# Altium schematic sheet Power Supply.SchDoc
size A; SheetNumber: 2; SheetTotal: 4
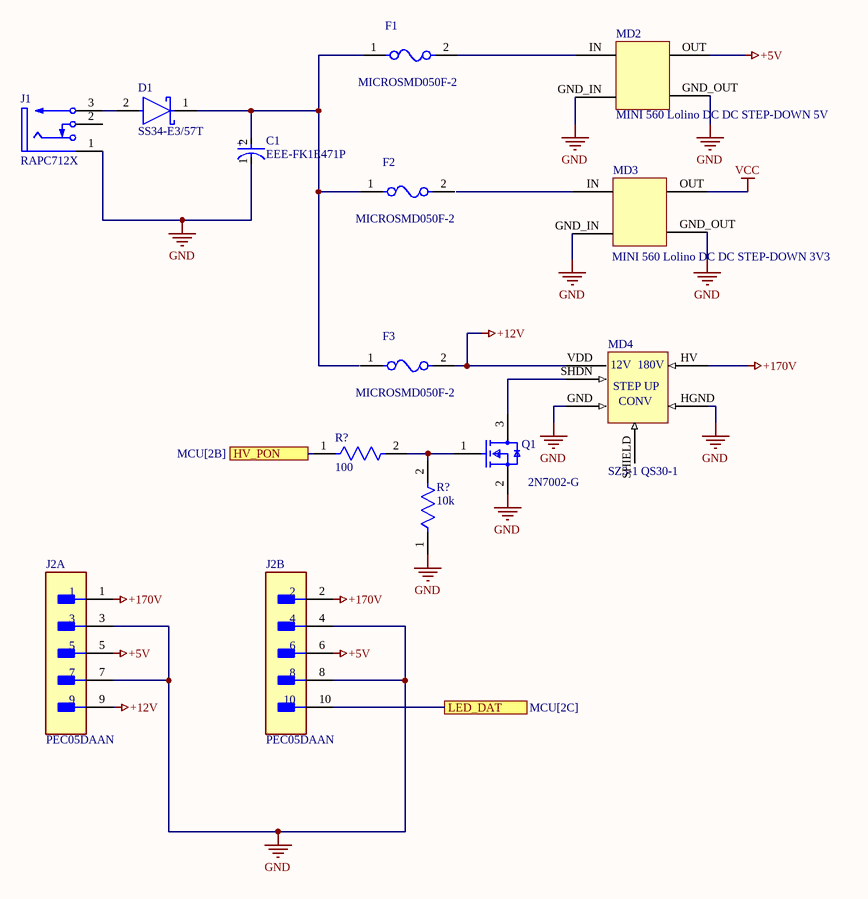
[diagram p0: Power Supply.SchDoc]

## Parts
(Parts that share a designator on the sheet are numbered #1, #2 ... from top to bottom, then left to right.)
C1  EEE-FK1E471P  [FP-FKG-MFG]
D1  SS34-E3/57T  [FP-95402-MFG]
F1  MICROSMD050F-2  [FP-microSMD-MFG]
F2  MICROSMD050F-2  [FP-microSMD-MFG]
F3  MICROSMD050F-2  [FP-microSMD-MFG]
J1  RAPC712X  [SWITCH-RAPC712X-3_V]
J2  PEC05DAAN  [FP-PEC05DAAN-MFG]  (parts A,B of 2)
MD2  MINI 560 Lolino DC DC STEP-DOWN 5V  [MINI 560 Lolino DC DC STEP-DOWN]
MD3  MINI 560 Lolino DC DC STEP-DOWN 3V3  [MINI 560 Lolino DC DC STEP-DOWN]
MD4  SZ3-1 QS30-1  [STEP_UP_180V]
Q1  2N7002-G  [FP-2N7002-G-IPC_C]
R?#1  100  [FP-RC0805-0_6-IPC_C]
R?#2  10k  [FP-RC0805-0_6-IPC_C]

## Ports
HV_PON (see MCU[2B]), LED_DAT (see MCU[2C])

## Nets
+5V: J2.5 J2.6 MD2.OUT
+12V: F3.2 J2.9 MD4.VDD
+170V: J2.1 J2.2 MD4.HV
GND: C1.1(C) J1.1 J2.3 J2.4 J2.7 J2.8 MD2.GND_IN MD2.GND_OUT MD3.GND_IN MD3.GND_OUT MD4.GND MD4.HGND Q1.2(SOURCE) R?#2.1
VCC: MD3.OUT
HV_PON: R?#1.1 ; port HV_PON
LED_DAT: J2.10 ; port LED_DAT
NetC1_2: C1.2(A) D1.1(C) F1.1 F2.1
NetD1_2: D1.2(A) J1.3
NetF1_2: F1.2 MD2.IN
NetMD4_SHDN: MD4.SHDN Q1.3(DRAIN)
NetQ1_1: Q1.1(GATE) R?#1.2 R?#2.2

Not connected (* = marked no-connect by the designer): F2 2; F3 1; J1 2; MD3 IN; MD4 SHIELD

## Notes on the sheet
- (in symbol CMP-05427-000095-1) +
- (in symbol STEP_UP_180V_MODULE) 12V; 180V; STEP UP; CONV

## Library data of the parts
C1 = CMP-05427-000095-1: CAP ALUM 470UF 20% 25V SMD; Dielectric Material: Aluminium; Life (Hours): 2000Hour; Impedance: 80mR; Leakage Current: 3uA; Polarity: Polar; Ripple Current (AC): 850mA; Packaging: Tape and Reel; Height: 10.2mm; Radiation Hardening: No; Mount: Surface Mount; Min Operating Temperature: -55°C; ESR (Equivalent Series Resistance): 80mR; Tolerance: 20%; Max Operating Temperature: 105°C; Contact Plating: Tin; Length: 10.2mm; Number of Pins: 2; Capacitance: 470uF; Case/Package: Radial; Height - Seated (Max): 0.413inch; Voltage Rating (DC): 25V; Construction: Cylindrical; Lead Free: Lead Free; Voltage: 25V; Material: Aluminium; Package Quantity: 500; Width: 12mm; Series: FK; RoHS Compliant: Yes; Voltage Rating: 25V; Ripple Current: 850mA; Termination: SMD/SMT; Diameter: 10mm
D1 = CMP-02539-000012-1: DIODE SCHOTTKY 40V 3A DO214AB; Manufacturer: Vishay; Max Junction Temp: +150°C; Peak Reverse Current: 0.5mA; Max Surge Forward Current: 100A; Standoff Height: 0mm; ComponentLink2Description: Datasheet; Device Class L3: Schottky Diodes; Height: 2.62mm; Max Repetitive Reverse Voltage: 40V; Lead Free: Yes; Package: 95402; Temperature Range High: +150°C; ComponentLink2URL: http://www.vishay.com/docs/88751/ss32.pdf; Temperature: -55°C to +150°C; Footprint Url: http://www.vishay.com/docs/95402/smc.pdf; Automotive: No; Forward Current: 3A; Category: Diode; Manufacturer Part Number: SS34-E3/57T; RoHS: TRUE; Device Class L2: Diodes; Mouser Description: Schottky Diodes & Rectifiers 3.0 Amp 40 Volt; Octopart: https://octopart.com/ss34-e3%2F57t-vishay-39552907; Temperature Range Low: -55°C; Device Class L1: Discrete Semiconductors; Digikey Description: DIODE SCHOTTKY 40V 3A DO214AB
F1-F3 = CMP-08606-000015-1: PTC RESET FUSE 13.2V 500MA 1210; Manufacturer: Littelfuse; Hold Current: 0.5A; Resistance: 0.25-0.9Ω; Trip Time: 0.05s; Value: 0.25-0.9Ω; Trip Current: 1A; Current Rating: 40A; Device Class L3: unset; ComponentLink2URL: https://www.littelfuse.com/~/media/electronics/datasheets/resettable_ptcs/littelfuse_ptc_microsmd_datasheet.pdf.pdf; Temperature: to +85°C; ComponentLink2Description: Datasheet; RoHS: TRUE; Category: Fuse; Ambient Temperature Range Low: -40°C; Lead Free: Yes; Device Class L1: Circuit Protection; Manufacturer Part Number: MICROSMD050F-2; Temperature Range High: +85°C; Ambient Temperature Range High: +85°C; Automotive: No; Height: 0.62mm; Digikey Description: PTC RESET FUSE 13.2V 500MA 1210; Voltage Rating: 13.2V; Package: microSMD; Octopart: https://octopart.com/microsmd050f-2-littelfuse-74214982; Device Class L2: PTC Resettable Fuses
J1 = CMP-2000-05383-1: Conn Powerjack Mini R/A PCMT, 5 A, 3-Pin THD, RoHS; Manufacturer: Switchcraft; Gender: Male; Current Rating: 5A; Connector Type: Jack; Dynamic Catalog: SwitchcraftInc; Other Names: Q2387461 / Q2526383 / RAPC712X-ND / SC237; Internal Switch(s): SingleSwitch,NormallyClosed; Catalog Drawings: RAPC7(1,2)2XSide / RAPC7(1,2)2XTop; Plug/Mating Plug Diameter: 2.5mmID,5.5mmOD; Number of Positions/Contacts: 2Conductors,2Contacts; Shielding: Unshielded; Mating Products: SC1539-ND / -CONNPLUGMINIPWR2CONDBLK/RED / SC1051-ND / -CONNPLUGMINIPOWER2CONDBLACK; Mounting Type: ThroughHole,RightAngle; Manufacturer URL: http://www.switchcraft.com/; Contact Material: Brass; Standard Package: 2,500; RoHS Information: SwitchcraftRoHSInfo; Termination: SolderEyelet(s); Housing Color: Black; Datasheet Version: Rev. A, 08/2005; Family: Barrel-PowerConnectors; Housing Material: Thermoplastic; Color: Black; Datasheet URL: https://datasheet.ciiva.com/391/rapc712x-cd-391666.pdf; Category: Connectors,Interconnects; Contact Material - Plating: Nickel
J2 = CMP-25680-000034-1: CONN HEADER VERT 10POS 2.54MM; Pitch: 0.1inch; Number of Positions: 10; Gender: Male; Connector Type: Male Pin; Contact Type: Male Pin; Height: 2.54mm; Termination: Solder; Packaging: Bulk; Housing Material: Plastic; Contact Mating Length: 0.23inch; Width: 5.08mm; Row Spacing: 0.1inch; Housing Color: Black; Mount: Through Hole; Contact Plating: Tin; Contact Material: Bronze; Color: Black; Package Quantity: 1; Length: 12.7mm; Lead Free: Lead Free; Number of Rows: 2; Number of Contacts: 10
MD2 MD3 = MINI 560 Lolino DC DC STEP-DOWN
MD4 = STEP_UP_180V_MODULE
Q1 = CMP-06369-000003-1: MOSFET N-CH 60V 0.115A SOT23-3; Manufacturer: Microchip; Standoff Height: 0.01mm; Rthja Max: 203°C/W; Continuous Drain Current: 115mA; Depletion Mode: False; Typ Forward Diode Voltage: 1.2V; Number Of Channels: 1; Power Dissipation: 0.36W; Turn Off Delay Time: 20ns; Threshold Vgs Min: 1V; Threshold Vgs Max: 2.5V; Drain To Source Resistance: 7.5Ω; Input Capacitace At Vds: 50pF @ 25V; Reverse Recovery Time: 400ns; Pulse Drain Current: 800mA; Gate To Source Voltage: 30V; Manufacturer Part Number: 2N7002-G; Ambient Temperature Range Low: -55°C; Temperature Range Low: -55°C; ComponentLink2Description: Datasheet; Automotive: No; Temperature Range High: +150°C; Temperature: -55°C to +150°C; Ambient Temperature Range High: +150°C; ComponentLink2URL: http://ww1.microchip.com/downloads/en/DeviceDoc/2N7002-N-Channel-Enhancement-Mode-Vertical-DMOS-FET-Data-Sheet-20005797A.pdf; Octopart: https://octopart.com/2n7002-g-microchip-47153309; Mouser Description: Mosfet; N-channel Enhancement Mode; 60V; 7.5 OHM3 SOT-23T/R; Lead Free: Yes; Number Of N Channels: 1; Turn On Delay Time: 20ns; RoHS: TRUE; Digikey Description: MOSFET N-CH 60V 0.115A SOT23-3; Category: Trans; Ipc Land Pattern Name: SOT95P237X100-3; Height: 1.12mm; Device Class L2: Transistors; Drain To Source Breakdown Voltage: 60V; Device Class L1: Discrete Semiconductors; Drain To Source Voltage: 60V; Device Class L3: MOSFETs; Package: 2N7002-G
R?#1 R?#2 = CMP-2100-03668-5: RES 100K OHM 1% 1/8W 0805; Power Rating: 125mW; Temperature Coefficient: 100ppm/°C; Voltage Rating (DC): 150V; Resistance: 100kR; Package Quantity: 1; Case/Package: 0805; Lead Pitch: 0.4mm; Case Code (Imperial): 0805; Construction: Rectangular; Number of Terminations: 2; RoHS Compliant: Yes; Max Power Dissipation: 125mW; Tolerance: 1%; Max Operating Temperature: 155°C; Resistance Tolerance: 1%; Lead Free: Lead Free; Packaging: Tape and Reel; Resistor Type: Thick Film; Min Operating Temperature: -55°C; Case Code (Metric): 2012; Series: RC; Technology: THICK FILM; Voltage Rating: 150V; Termination: SMD/SMT; Width: 0.049inch; Number of Pins: 2; Features: Moisture Resistant; Military Standard: Not; Length: 0.079inch; Depth: 1.25mm; Size Code: 0805; Height: 0.024inch